# EAGLE design TwirrePDB (EAGLE 7.4.0)
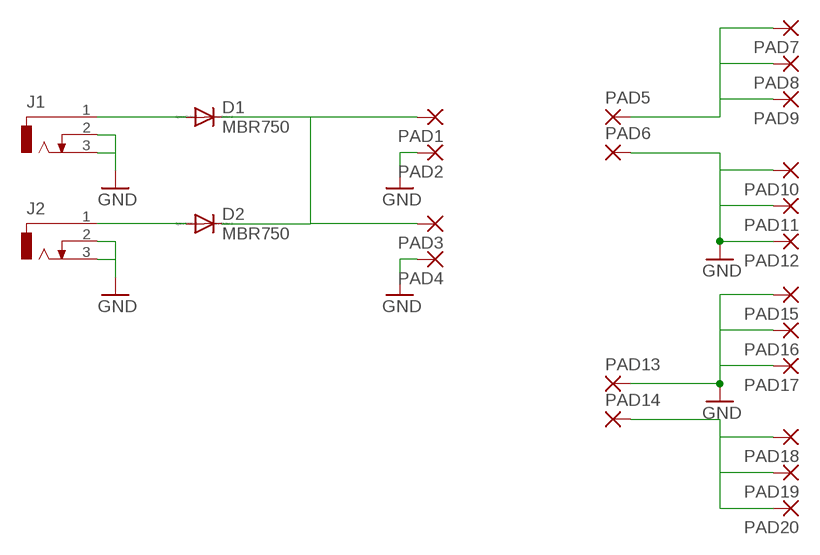
[diagram p0: schematic, sheet 1]

## Parts
D1  MBR750  [TO220AC]
D2  MBR750  [TO220AC]
J1  DCJ0303  [DCJ0303]
J2  DCJ0303  [DCJ0303]
PAD1  2,54/0,9  [2,54/0,9]
PAD2  2,54/0,9  [2,54/0,9]
PAD3  2,54/0,9  [2,54/0,9]
PAD4  2,54/0,9  [2,54/0,9]
PAD5  2,54/0,9  [2,54/0,9]
PAD6  2,54/0,9  [2,54/0,9]
PAD7  2,54/0,9  [2,54/0,9]
PAD8  2,54/0,9  [2,54/0,9]
PAD9  2,54/0,9  [2,54/0,9]
PAD10  2,54/0,9  [2,54/0,9]
PAD11  2,54/0,9  [2,54/0,9]
PAD12  2,54/0,9  [2,54/0,9]
PAD13  2,54/0,9  [2,54/0,9]
PAD14  2,54/0,9  [2,54/0,9]
PAD15  2,54/0,9  [2,54/0,9]
PAD16  2,54/0,9  [2,54/0,9]
PAD17  2,54/0,9  [2,54/0,9]
PAD18  2,54/0,9  [2,54/0,9]
PAD19  2,54/0,9  [2,54/0,9]
PAD20  2,54/0,9  [2,54/0,9]

## Nets
5V: PAD14.1(P) PAD18.1(P) PAD19.1(P) PAD20.1(P)
12V: PAD5.1(P) PAD7.1(P) PAD8.1(P) PAD9.1(P)
COMB: D1.C D2.C PAD1.1(P) PAD3.1(P)
GND: J1.2 J1.3 J2.2 J2.3 PAD2.1(P) PAD4.1(P) PAD6.1(P) PAD10.1(P) PAD11.1(P) PAD12.1(P) PAD13.1(P) PAD15.1(P) PAD16.1(P) PAD17.1(P)
N$1: D2.A J2.1
N$2: D1.A J1.1

## Library data of the parts
D1 D2 = diode:MBR750: DIODE barrier rectifier, 7.5 A, 50 V
J1 J2 = con-jack:DCJ0303: DC POWER JACK Source: DCJ0303.pdf; OC_FARNELL: unknown; OC_NEWARK: unknown
PAD1-PAD20 = wirepad:2,54/0,9: THROUGH-HOLE PAD

## Board
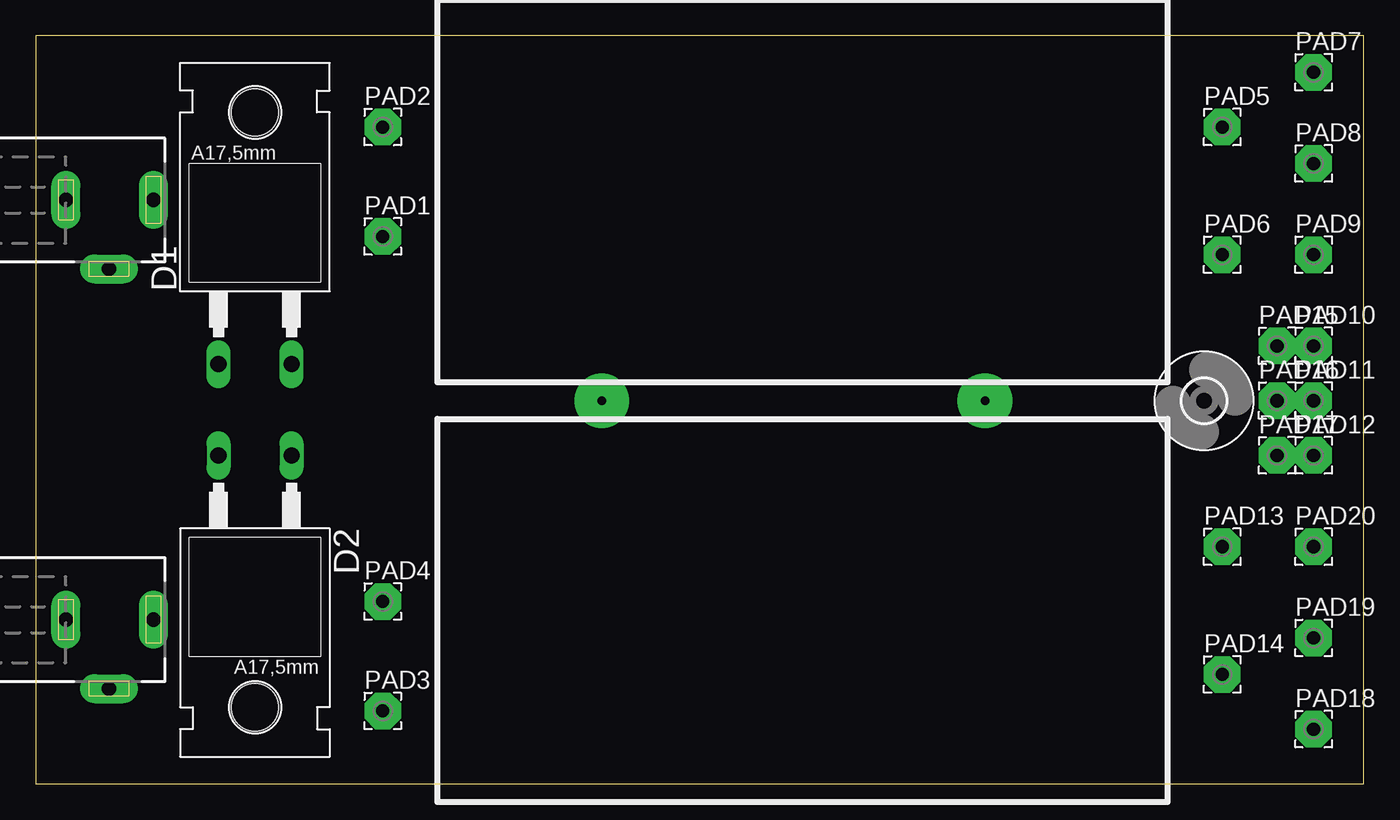
[diagram p1: board, top side]
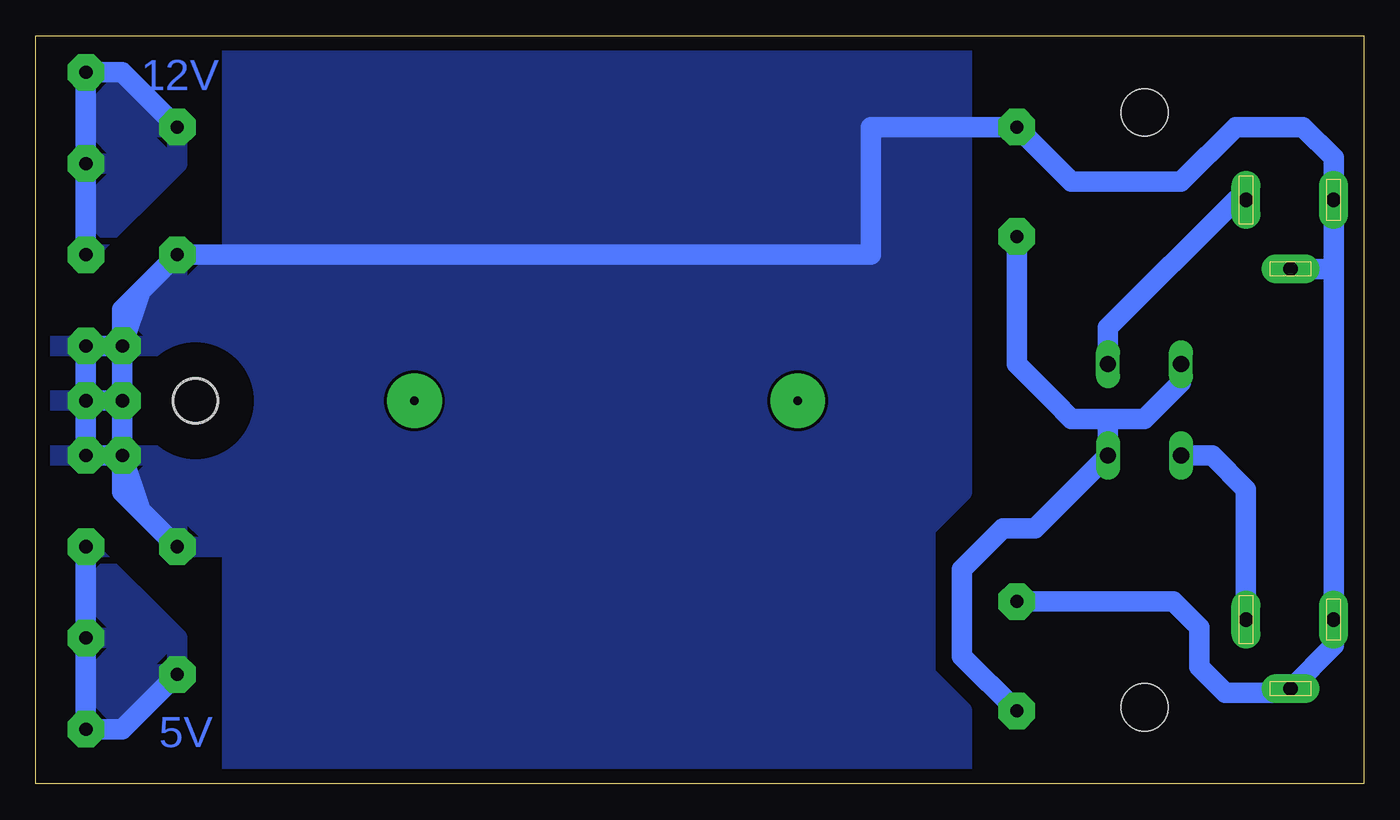
[diagram p2: board, bottom side, seen from below]

Size 92.38 x 52.06 mm. Coordinates in mm from the lower left corner, seen from the top.
Outline: 0,0 92.38,0 92.38,52.06 0,52.06 0,0
Copper layers (1*16): Top 0.035mm / dielectric 1.5mm / Bottom 0.035mm
Design rules "default": minimum track width 10mil, minimum drill 24mil, track to track 8mil, track to pad 8mil, pad to pad 8mil, via to via 8mil, smd to smd 8mil, copper to edge 40mil, drill to drill 8mil, minimum pad ring 10mil, minimum via ring 8mil, stop-mask expansion 4mil, vias tented up to drill 0mil, thermal gap 10mil
Holes 3.2 mm at 81.28,26.67

### Footprints (pad centres in the part's own frame; a part is rotated, then mirrored left to right if it is on the bottom)
TO220AC = drill 1.118 long: A 2.54,-6.35; C -2.54,-6.35 | hole 3.302: 0,11.176
DCJ0303 = drill 1 pad 2 long: 1 0,3.1; 2 4.8,0; 3 0,-3
2,54/0,9 = drill 0.914 pad 2.54 octagon: 1 0,0
3,0 = hole 3: 0,0

### Placement (x,y rotation side)
D1  15.24,35.56 0 top
D2  15.24,16.51 180 top
J1  5.08,40.64 270 top
J2  5.08,11.43 270 top
PAD1  24.13,38.1 0 top
PAD2  24.13,45.72 0 top
PAD3  24.13,5.08 0 top
PAD4  24.13,12.7 0 top
PAD5  82.55,45.72 0 top
PAD6  82.55,36.83 0 top
PAD7  88.9,49.53 0 top
PAD8  88.9,43.18 0 top
PAD9  88.9,36.83 0 top
PAD10  88.9,30.48 0 top
PAD11  88.9,26.67 0 top
PAD12  88.9,22.86 0 top
PAD13  82.55,16.51 0 top
PAD14  82.55,7.62 0 top
PAD15  86.36,30.48 0 top
PAD16  86.36,26.67 0 top
PAD17  86.36,22.86 0 top
PAD18  88.9,3.81 0 top
PAD19  88.9,10.16 0 top
PAD20  88.9,16.51 0 top
U$1  [3,0]  81.28,26.67 0 top

### Tracks (layer width: path | path; a pad name or v marks a point on that pad's centre or on a via)
5V
  Bottom 1.422: PAD14.1 86.36,3.81 PAD18.1 PAD19.1 PAD20.1
  pour Bottom: 88.9,16.51 82.55,10.16 82.55,7.62 86.36,3.81 88.9,3.81
12V
  Bottom 1.422: PAD9.1 PAD8.1 PAD7.1 86.36,49.53 PAD5.1
  pour Bottom: 82.55,45.72 86.36,49.53 88.9,49.53 88.9,36.83 82.55,43.18
COMB
  Bottom 1.422: D1.C 12.7,27.94 13.97,26.67 15.24,25.4 17.78,25.4 | 17.78,25.4 20.32,25.4 21.59,26.67 24.13,29.21 PAD1.1 | 17.78,25.4 D2.C 22.86,17.78 25.1,17.78 27.94,14.94 27.94,8.89 PAD3.1
GND
  Bottom 1.422: 2.08,35.84 J2.3 2.08,9.63 J2.2 5.08,6.35 9.63,6.35 11.43,8.15 11.43,10.9 13.23,12.7 PAD4.1 | 2.08,35.84 J1.3 2.08,43.57 4.23,45.72 8.89,45.72 12.7,41.91 20.32,41.91 PAD2.1 34.29,45.72 34.29,36.83 PAD6.1 | J1.2 2.08,35.84 | PAD11.1 PAD12.1 PAD17.1 85.09,19.05 PAD13.1 86.36,20.32 86.36,33.02 PAD6.1 | PAD11.1 PAD10.1 PAD15.1 85.09,34.29 PAD6.1 | PAD11.1 PAD16.1
  pour Bottom: 27.94,0 78.74,0 78.74,16.51 82.55,16.51 85.09,19.05 85.09,22.86 91.44,22.86 91.44,30.48 85.09,30.48 85.09,33.99 82.25,36.83 78.74,36.83 78.74,52.07 27.94,52.07 27.94,20.32 30.48,17.78 30.48,7.62 27.94,5.08
N$1
  Bottom 1.422: D2.A 10.53,22.86 8.18,20.51 J2.1
N$2
  Bottom 1.422: J1.1 8.89,40.64 17.78,31.75 D1.A
N$3  (via drill 0.6 pad 3.81)
  other vias: 39.37,26.67
N$4  (via drill 0.6 pad 3.81)
  other vias: 66.04,26.67

### Text on the board
Bottom: 12V | 5V